# EAGLE design piccontrolissimo (EAGLE 9.1.3)
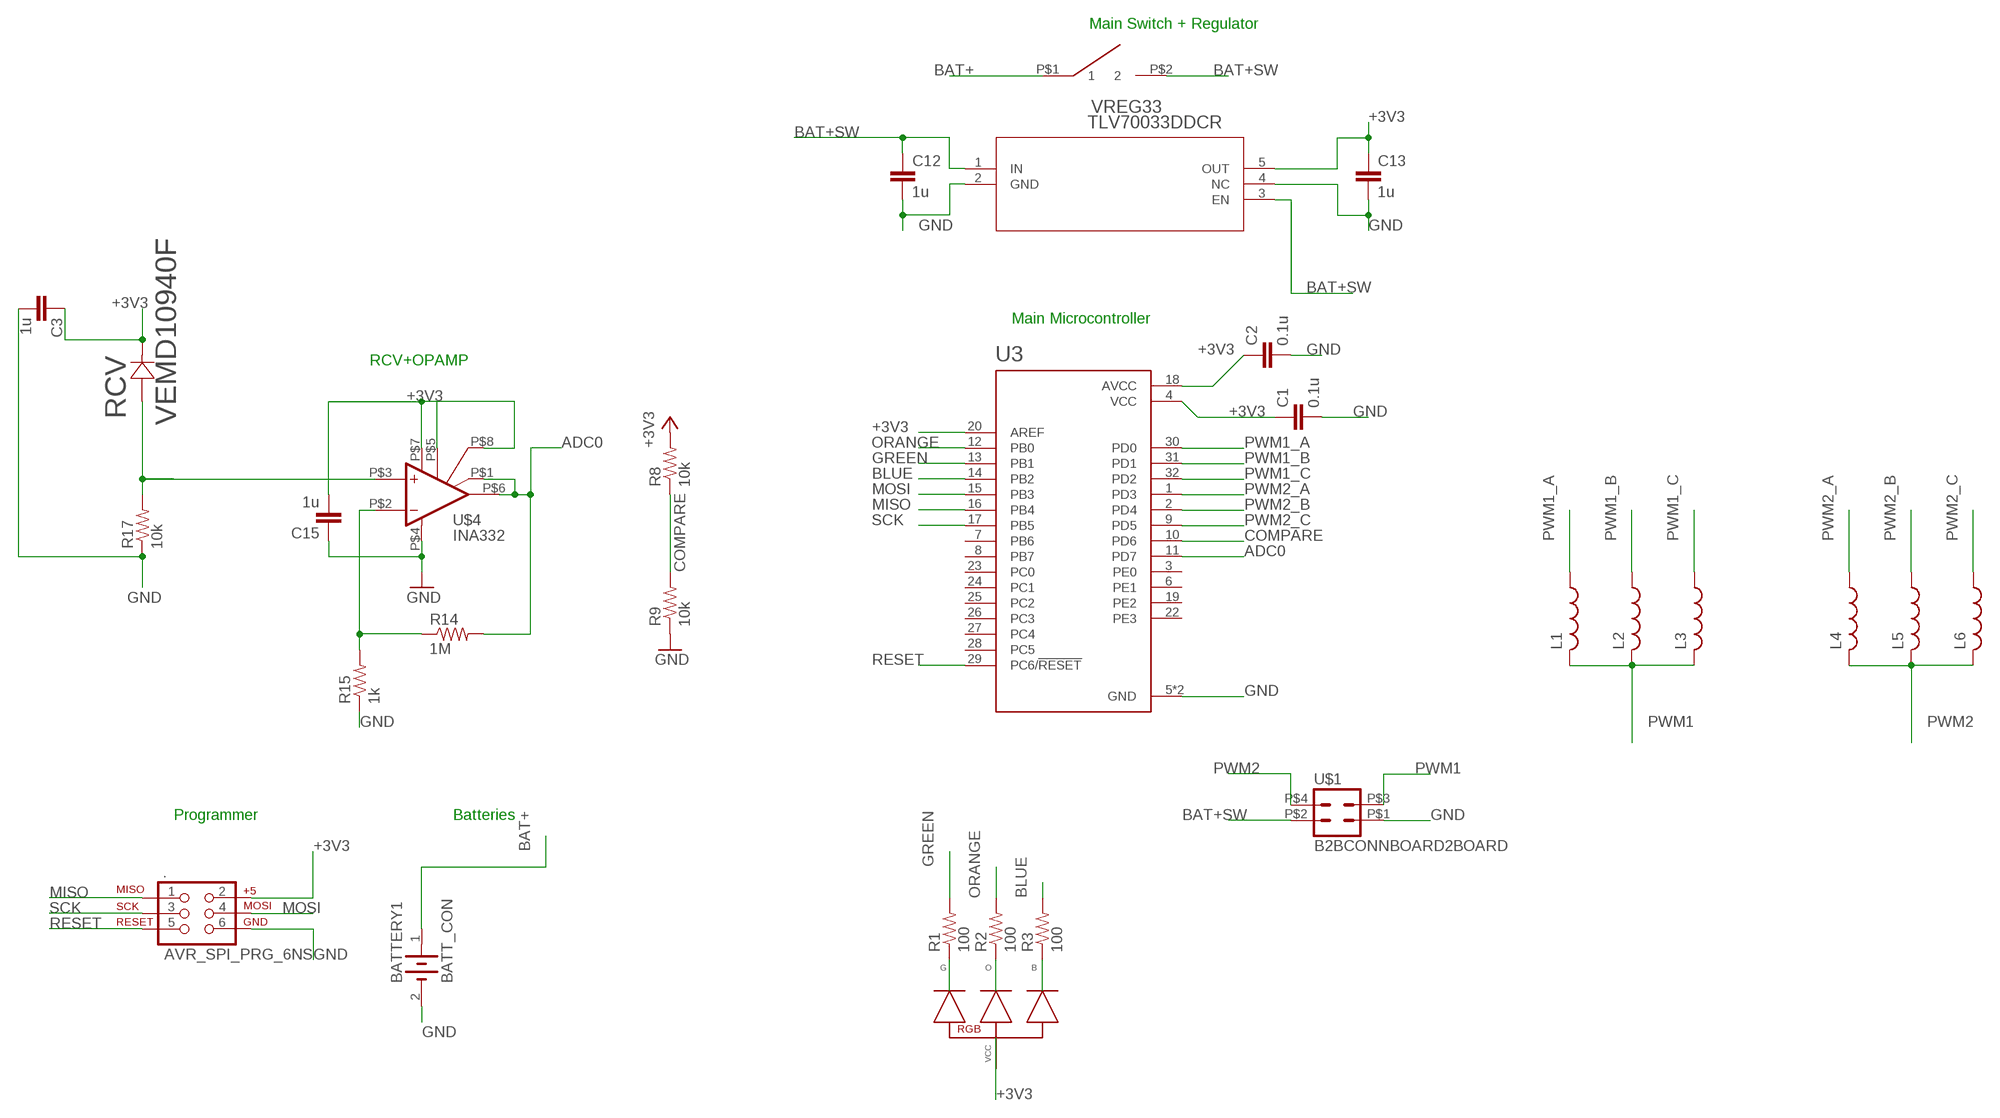
[diagram p0: schematic, sheet 1]

## Parts
.  AVR_SPI_PRG_6NS  [2X3-NS]
BATTERY1  BATT_CON  [2X2BATTCON]
C1  0.1u  C-EUC0603  [C0603]
C2  0.1u  C-EUC0603  [C0603]
C3  1u  C-EUC0603  [C0603]
C12  1u  C-EUC0603  [C0603]
C13  1u  C-EUC0603  [C0603]
C15  1u  C-EUC0603  [C0603]
L1  L-USL0201  [L0201]
L2  L-USL0201  [L0201]
L3  L-USL0201  [L0201]
L4  L-USL0201  [L0201]
L5  L-USL0201  [L0201]
L6  L-USL0201  [L0201]
R1  100  R-US_R0603  [R0603]
R2  100  R-US_R0603  [R0603]
R3  100  R-US_R0603  [R0603]
R8  10k  R-US_R0603  [R0603]
R9  10k  R-US_R0603  [R0603]
R14  1M  R-US_R0603  [R0603]
R15  1k  R-US_R0603  [R0603]
R17  10k  R-US_R0603  [R0603]
RCV  VEMD10940F  [VEMD10940F]
RGB1  RGBLED  [RGBLED]
SWITCH  DIP01  [DIP01]
U3  ATMEGA328PB-AUR  [QFP80P900X900X120-32N]
U$1  B2BCONNBOARD2BOARD  [B2B]
U$4  INA332  [INA332]
VREG33  TLV70033DDCR  [DDC5]

## Nets
+3V3: ..2 C1.1 C2.1 C3.1 C13.1 C15.2 R8.2 RCV.CA- RGB1.VCC U3.4(VCC) U3.18(AVCC) U3.20(AREF) U$4.P$5(VREF) U$4.P$7(V+) U$4.P$8(SHDN) VREG33.5(OUT)
ADC0: R14.2 U3.11(PD7) U$4.P$1(RG) U$4.P$6(OUT)
BAT+: BATTERY1.1(+) SWITCH.P$1
BAT+SW: C12.1 SWITCH.P$2 U$1.P$2 VREG33.1(IN) VREG33.3(EN)
BLUE: R3.2 U3.14(PB2)
BLUER: R3.1 RGB1.BLUE
COMPARE: R8.1 R9.2 U3.10(PD6)
GND: ..6 BATTERY1.2(-) C1.2 C2.2 C3.2 C12.2 C13.2 C15.1 R9.1 R15.1 R17.1 U3.5(GND) U3.21(GND) U$1.P$1 U$4.P$4(V-) VREG33.2(GND) VREG33.4(NC)
GREEN: R1.2 U3.13(PB1)
GREENR: R1.1 RGB1.GREEN
MISO: ..1 U3.16(PB4)
MOSI: ..4 U3.15(PB3)
N$3: R14.1 R15.2 U$4.P$2(-IN)
N$23: R17.2 RCV.AN+ U$4.P$3(+IN)
ORANGE: R2.2 U3.12(PB0)
ORANGER: R2.1 RGB1.ORANGE
PWM1: L1.2 L2.2 L3.2 U$1.P$3
PWM1_A: L1.1 U3.30(PD0)
PWM1_B: L2.1 U3.31(PD1)
PWM1_C: L3.1 U3.32(PD2)
PWM2: L4.2 L5.2 L6.2 U$1.P$4
PWM2_A: L4.1 U3.1(PD3)
PWM2_B: L5.1 U3.2(PD4)
PWM2_C: L6.1 U3.9(PD5)
RESET: ..5 U3.29(PC6/!RESET)
SCK: ..3 U3.17(PB5)
Unconnected: U3.3(PE0) U3.6(PE1) U3.7(PB6) U3.8(PB7) U3.19(PE2) U3.22(PE3) U3.23(PC0) U3.24(PC1) U3.25(PC2) U3.26(PC3) U3.27(PC4) U3.28(PC5)

## Notes on the sheet
- Main Switch + Regulator
- Main Microcontroller
- RCV+OPAMP
- Programmer | Batteries

## Library data of the parts
. = Base:AVR_SPI_PRG_6: AVR ISP 6 Pin This is the reduced ISP connector for AVR programming. Common on Arduino. This footprint will take up less PCB space and can be used with a 10-pin to 6-pin adapter such as SKU: BOB-08508
BATTERY1 = Base:BATT_CON
C1-C3 C12 C13 C15 = Thesis_Lib:C-EU: CAPACITOR, European symbol
L1-L6 = Base:L-US: INDUCTOR, American symbol
R1-R3 R8 R9 R14 R15 R17 = Thesis_Lib:R-US_: RESISTOR, American symbol
RCV = Base:VEMD10940F
RGB1 = Base:RGBLED
SWITCH = Base:DIP01
U3 = ATMEGA328PB-AUR:ATMEGA328PB-AUR: ATmega Series 20 MHz 32 KB Flash 2 KB SRAM 8-Bit Microcontroller - TQFP-32; DESCRIPTION: AVR microcontroller; EEPROM: 1024B; SRAM: 2kB; Flash: 32kB; TQFP32; DIGI-KEY_PART_NUMBER: ATMEGA328PB-AURCT-ND; DIGI-KEY_PURCHASE_URL: https://www.digikey.com/product-detail/en/microchip-technology/ATMEGA328PB-AUR/ATMEGA328PB-AURCT-ND/5722706?utm_source=snapeda&utm_medium=aggregator&utm_campaign=symbol; MF: Microchip; MP: ATMEGA328PB-AUR; PACKAGE: TQFP-32 Microchip
U$1 = Base:B2BCONN
U$4 = Thesis_Lib:INA332
VREG33 = Thesis_Lib:TLV70033DDCR; MANUFACTURER_PART_NUMBER: TLV70033DDCR; VENDOR: Texas Instruments

## Board
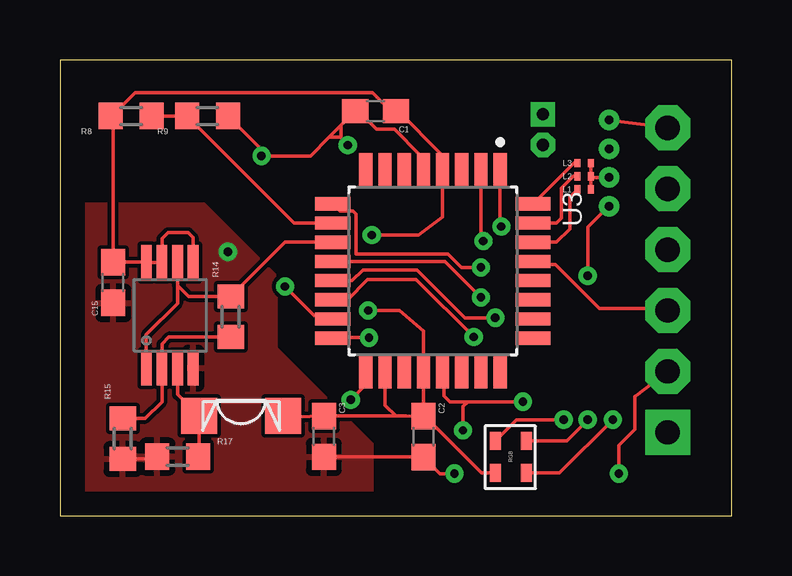
[diagram p1: board, top side]
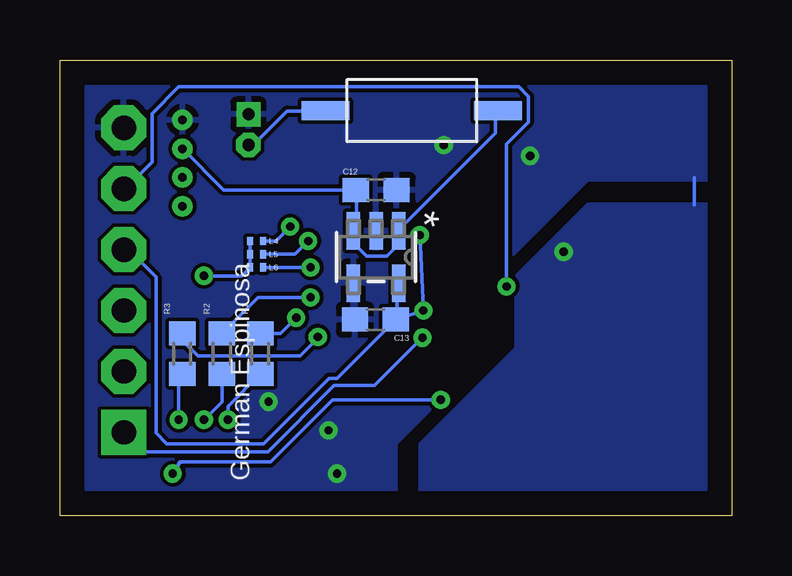
[diagram p2: board, bottom side, seen from below]

Size 28 x 19 mm. Coordinates in mm from the lower left corner, seen from the top.
Outline: 0,0 28,0 28,19 0,19 0,0
Copper layers (1*16): Top 0.035mm / dielectric 1.5mm / Bottom 0.035mm
Design rules "default": minimum track width 6mil, minimum drill 0.35mm, track to track 6mil, track to pad 6mil, pad to pad 6mil, via to via 6mil, smd to smd 6mil, copper to edge 40mil, drill to drill 6mil, minimum pad ring 10mil, minimum via ring 8mil, stop-mask expansion 4mil, vias tented up to drill 0mil, thermal gap 10mil

### Footprints (pad centres in the part's own frame; a part is rotated, then mirrored left to right if it is on the bottom)
2X3-NS = drill 1.016 pad 1.88 square: 1 -6.35,0 | drill 1.016 pad 1.88 octagon: 2 1.27,0; 3 -3.81,0; 4 3.81,0; 5 -1.27,0; 6 6.35,0
2X2BATTCON = drill 0.508 pad 0.94 octagon: 1 0,0 | drill 0.5 pad 0.94 square: 2 0,1.27
C0603 = smd 1.1 x 1: 1 -0.85,0; 2 0.85,0
L0201 = smd 0.25 x 0.35: 1 -0.275,0; 2 0.275,0
R0603 = smd 1 x 1.1: 1 -0.85,0; 2 0.85,0
VEMD10940F = smd 1.5 x 1.5: AN+ 0.5,1.749; CA- 0.5,-1.751
RGBLED = smd 0.75 x 0.45: BLUE 0.675,0.65; GREEN -0.675,-0.65; ORANGE -0.675,0.65; VCC 0.675,-0.65
DIP01 = smd 2 x 0.8: P$1 -3.6,0; P$2 3.6,0
QFP80P900X900X120-32N = smd 1.47 x 0.55: 1 -4.17,2.8; 2 -4.17,2; 3 -4.17,1.2; 4 -4.17,0.4; 5 -4.17,-0.4; 6 -4.17,-1.2; 7 -4.17,-2; 8 -4.17,-2.8; 17 4.17,-2.8; 18 4.17,-2; 19 4.17,-1.2; 20 4.17,-0.4; 21 4.17,0.4; 22 4.17,1.2; 23 4.17,2; 24 4.17,2.8 | smd 0.55 x 1.47: 9 -2.8,-4.17; 10 -2,-4.17; 11 -1.2,-4.17; 12 -0.4,-4.17; 13 0.4,-4.17; 14 1.2,-4.17; 15 2,-4.17; 16 2.8,-4.17; 25 2.8,4.17; 26 2,4.17; 27 1.2,4.17; 28 0.4,4.17; 29 -0.4,4.17; 30 -1.2,4.17; 31 -2,4.17; 32 -2.8,4.17
B2B = drill 0.35: P$1 -1.8,-0.01; P$2 -0.6,-0.01; P$3 0.6,-0.01; P$4 1.8,-0.01
INA332 = smd 0.45 x 1.45: P$1 0,-2.2; P$2 0.65,-2.2; P$3 1.3,-2.2; P$4 1.95,-2.2; P$5 1.95,2.2; P$6 1.3,2.2; P$7 0.65,2.2; P$8 0,2.2
DDC5 = smd 1.575 x 0.559: 1 -1.092,0.95; 2 -1.092,0; 3 -1.092,-0.95; 4 1.092,-0.95; 5 1.092,0.95

### Placement (x,y rotation side)
.  25.34,9.82 90 top
BATTERY1  20.14,15.46 0 bottom
C1  13.16,16.87 180 top
C2  15.15,3.29 270 top
C3  11,3.3 270 top
C12  14.82,13.58 0 bottom
C13  14.85,8.17 180 bottom
C15  2.22,9.72 90 top
L1  21.85,13.6 0 top
L2  21.85,14.15 0 top
L3  21.85,14.7 0 top
L4  19.8,11.45 180 bottom
L5  19.8,10.9 180 bottom
L6  19.8,10.35 180 bottom
R1  19.65,6.75 90 bottom
R2  21.25,6.75 90 bottom
R3  22.9,6.75 90 bottom
R8  2.97,16.66 180 top
R9  6.15,16.66 180 top
R14  7.12,8.29 90 top
R15  2.62,3.21 90 top
R17  4.91,2.46 0 top
RCV  7.55,3.65 90 top
RGB1  18.8,2.45 270 top
SWITCH  13.33,16.89 0 bottom
U3  15.55,10.2 270 top
U$1  22.9,14.7 270 top
U$4  3.6,8.35 0 top
VREG33  14.82,10.78 270 bottom

### Tracks (layer width: path | path; a pad name or v marks a point on that pad's centre or on a via)
+3V3  (via drill 0.35)
  Top 0.152: RCV.CA- 9.25,4.1 C3.1 13,4.15 14,4.15 | U$4.P$5 5.55,11.6 5.35,11.8 4.5,11.8 4.25,11.55 U$4.P$7 U$4.P$8 3.58,10.57 C15.2 2.22,16.56 R8.2 2.22,16.72 3.13,17.63 13.04,17.63 13.65,17.02 13.95,17.02 C1.1 14.11,16.87 15.94,15.04 | C2.1 14.43,4.15 14,4.15 | C2.1 15.21,4.14 17.57,1.77 RGB1.VCC 18.22,1.63 | C2.1 U3.20 15.15,7.7 14.15,8.55 14,8.55 v12.85,8.55 | U3.18 13.55,4.6 14,4.15 | 15.94,15.04 15.94,14.43 U3.4 15.95,14.4 | 25.38,11.08 ..2 25.23,11.23 | 15.94,15.04 15.95,14.4 | v13,11.7 14.95,11.7 15.95,12.45 15.95,14.4
  Bottom 0.152: C13.1 13.95,8.18 13.95,9.55 VREG33.5 | 14.41,8.03 14.11,8.03 C13.1 | 25.23,11.23 25.26,11.2 | 25.26,11.2 ..2 | C13.1 16.45,5.72 16.78,5.72 19.51,3 23.55,3 24,3.45 24,9.94 25.26,11.2 | C13.1 v12.85,8.55 v13,11.7
ADC0
  Top 0.152: U3.11 9.38,11.4 R14.2 5.36,9.14 4.9,9.6 U$4.P$6 4.9,8.85 3.6,7.55 U$4.P$1
BAT+
  Bottom 0.152: SWITCH.P$1 17,16.87 18.53,16.87 20.05,15.34 BATTERY1.1
BAT+SW
  Bottom 0.152: U$1.P$2 21.17,13.58 C12.1 15.63,13.52 15.63,11.99 VREG33.3 15.63,11.84 15.63,11.23 15.22,10.82 14.36,10.82 13.95,11.23 13.95,11.84 VREG33.1 13.8,11.99 9.84,15.95 9.84,16.87 SWITCH.P$2
BLUE  (via drill 0.35)
  Top 0.152: v17.25,7.45 14.85,9.85 12.83,9.85 11.98,9 U3.14
  Bottom 0.152: R3.2 22.9,7.3 22.25,6.65 18,6.65 17.25,7.4 v17.25,7.45
BLUER  (via drill 0.35)
  Top 0.152: v23.05,4 20.82,1.77 RGB1.BLUE
  Bottom 0.152: R3.1 23.05,5.75 v23.05,4
COMPARE
  Top 0.152: R8.1 R9.2 9.76,12.2 U3.10
GND  (via drill 0.35)
  Top 0.152: R15.1 3.96,2.36 R17.1 | C3.2 14,2.45 | 14,2.45 14.43,2.45 | 14,2.45 C2.2 15.84,1.75 v16.45,1.75 | R9.1 8.4,15.26 v8.4,15 10.44,15 11.22,15.78 | 11.22,15.78 11.72,16.28 | 11.72,16.28 C1.2 12.43,16.87 13.19,16.11 13.95,16.11 15.02,15.04 15.02,14.43 U3.5 | U3.21 16,5.98 16,5 16.25,4.75 17,4.75 | 17,4.75 v19.3,4.75 | 11.22,15.78 11.67,15.78 v12,15.45 11.72,15.73 11.72,16.28 | v16.8,3.55 16.8,4 16.8,4.55 17,4.75 | U$1.P$1 ..6
  Bottom 0.152: 1.55,14.1 1.55,12.95
  other vias: 7,11
  pour Top: 6,13 0,13 0,0 13,0 13,3 9,7 9,9 9,10
  pour Bottom: 1,14 1,18 27,18 27,1 14,1 14,3 10,7 10,10 6,14
  pour Bottom: 1,13 1,1 13,1 13,3 9,7 9,10 6,13
GREEN  (via drill 0.35)
  Top 0.152: v18.15,8.25 16.88,8.25 14.88,10.25 12.63,10.25 12.18,9.8 U3.13
  Bottom 0.152: v18.15,8.25 18.8,7.6 R1.2
GREENR  (via drill 0.35)
  Top 0.152: v21,4 19.02,4 RGB1.GREEN
  Bottom 0.152: R1.1 21,4.55 v21,4
MISO  (via drill 0.35)
  Top 0.152: v12.89,7.42 11.52,7.42 U3.16
  Bottom 0.152: ..1 25.23,3.46 24.43,2.66 19.33,2.66 16.56,5.42 14.89,5.42 v12.89,7.42
MOSI  (via drill 0.35)
  Top 0.152: v9.38,9.55 10.6,8.33 11.36,8.33 U3.15
  Bottom 0.152: v9.38,9.55 9.38,15.5 8.47,16.41 8.47,17.48 8.87,17.88 23.04,17.88 24.16,16.76 24.16,14.73 25.23,13.67 ..4
N$3
  Top 0.152: R14.1 4.54,7.44 4.25,7.15 U$4.P$2 4.25,4.75 3.56,4.06 R15.2
N$23
  Top 0.152: R17.2 5.8,2.5 RCV.AN+ 4.9,5.05 U$4.P$3
ORANGE  (via drill 0.35)
  Top 0.152: v17.55,9.1 16.05,10.6 U3.12
  Bottom 0.152: v17.55,9.1 19.75,9.1 R2.2
ORANGER  (via drill 0.35)
  Top 0.152: v22,4 21.12,3.12 RGB1.ORANGE
  Bottom 0.152: R2.1 21.25,4.75 v22,4
PWM1
  Top 0.152: L3.2 L2.2 | L2.2 22.12,14.12 | 22.12,14.12 L1.2 | U$1.P$3 22.18,14.1 L2.2 | 22.12,14.12 22.18,14.12 L2.2
PWM1_A
  Top 0.152: U3.30 20.7,11.4 21.25,11.95 21.25,13.28 L1.1
PWM1_B
  Top 0.152: U3.31 20.7,12.2 20.9,12.4 20.9,13.65 21.4,14.15 L2.1
PWM1_C
  Top 0.152: U3.32 21.42,14.7 L3.1
PWM2  (via drill 0.35)
  Top 0.152: U$1.P$4 22.88,12.91 22,12.04 v22,10
  Bottom 0.152: L5.2 L6.2 20.43,10 v22,10 | L5.2 20.07,10.93 | 20.07,10.93 L4.2 | L5.2 20.05,10.93 20.07,10.93
PWM2_A  (via drill 0.35)
  Top 0.152: U3.1 18.35,12.1 v18.4,12.05
  Bottom 0.152: v18.4,12.05 19,11.45 L4.1
PWM2_B  (via drill 0.35)
  Top 0.152: U3.2 17.55,11.55 v17.65,11.45
  Bottom 0.152: v17.65,11.45 18.2,10.9 L5.1
PWM2_C  (via drill 0.35)
  Top 0.152: 17.05,10.35 v17.55,10.35 16.73,10.35 16.18,10.91 12.35,10.91 12.34,10.91 12.34,12.57 12.21,12.7 11.68,12.7 U3.9 12,13
  Bottom 0.152: v17.55,10.35 L6.1
RESET
  Top 0.152: U3.29 19.75,10.47 20.66,10.47 22.49,8.64 25.23,8.64 ..5
SCK  (via drill 0.35)
  Top 0.152: v12.12,4.83 12.73,5.44 12.73,5.9 U3.17 | v23.3,1.75 23.3,2.92 23.97,3.59 23.97,4.97 24,5 ..3
  Bottom 0.152: v12.12,4.83 16.63,4.83 19.23,2.24 23,2.24 v23.3,1.75 | 25.38,5.9 ..3

### Text on the board
bNames: German Espinosa